# EAGLE design net (EAGLE 7.0.0)
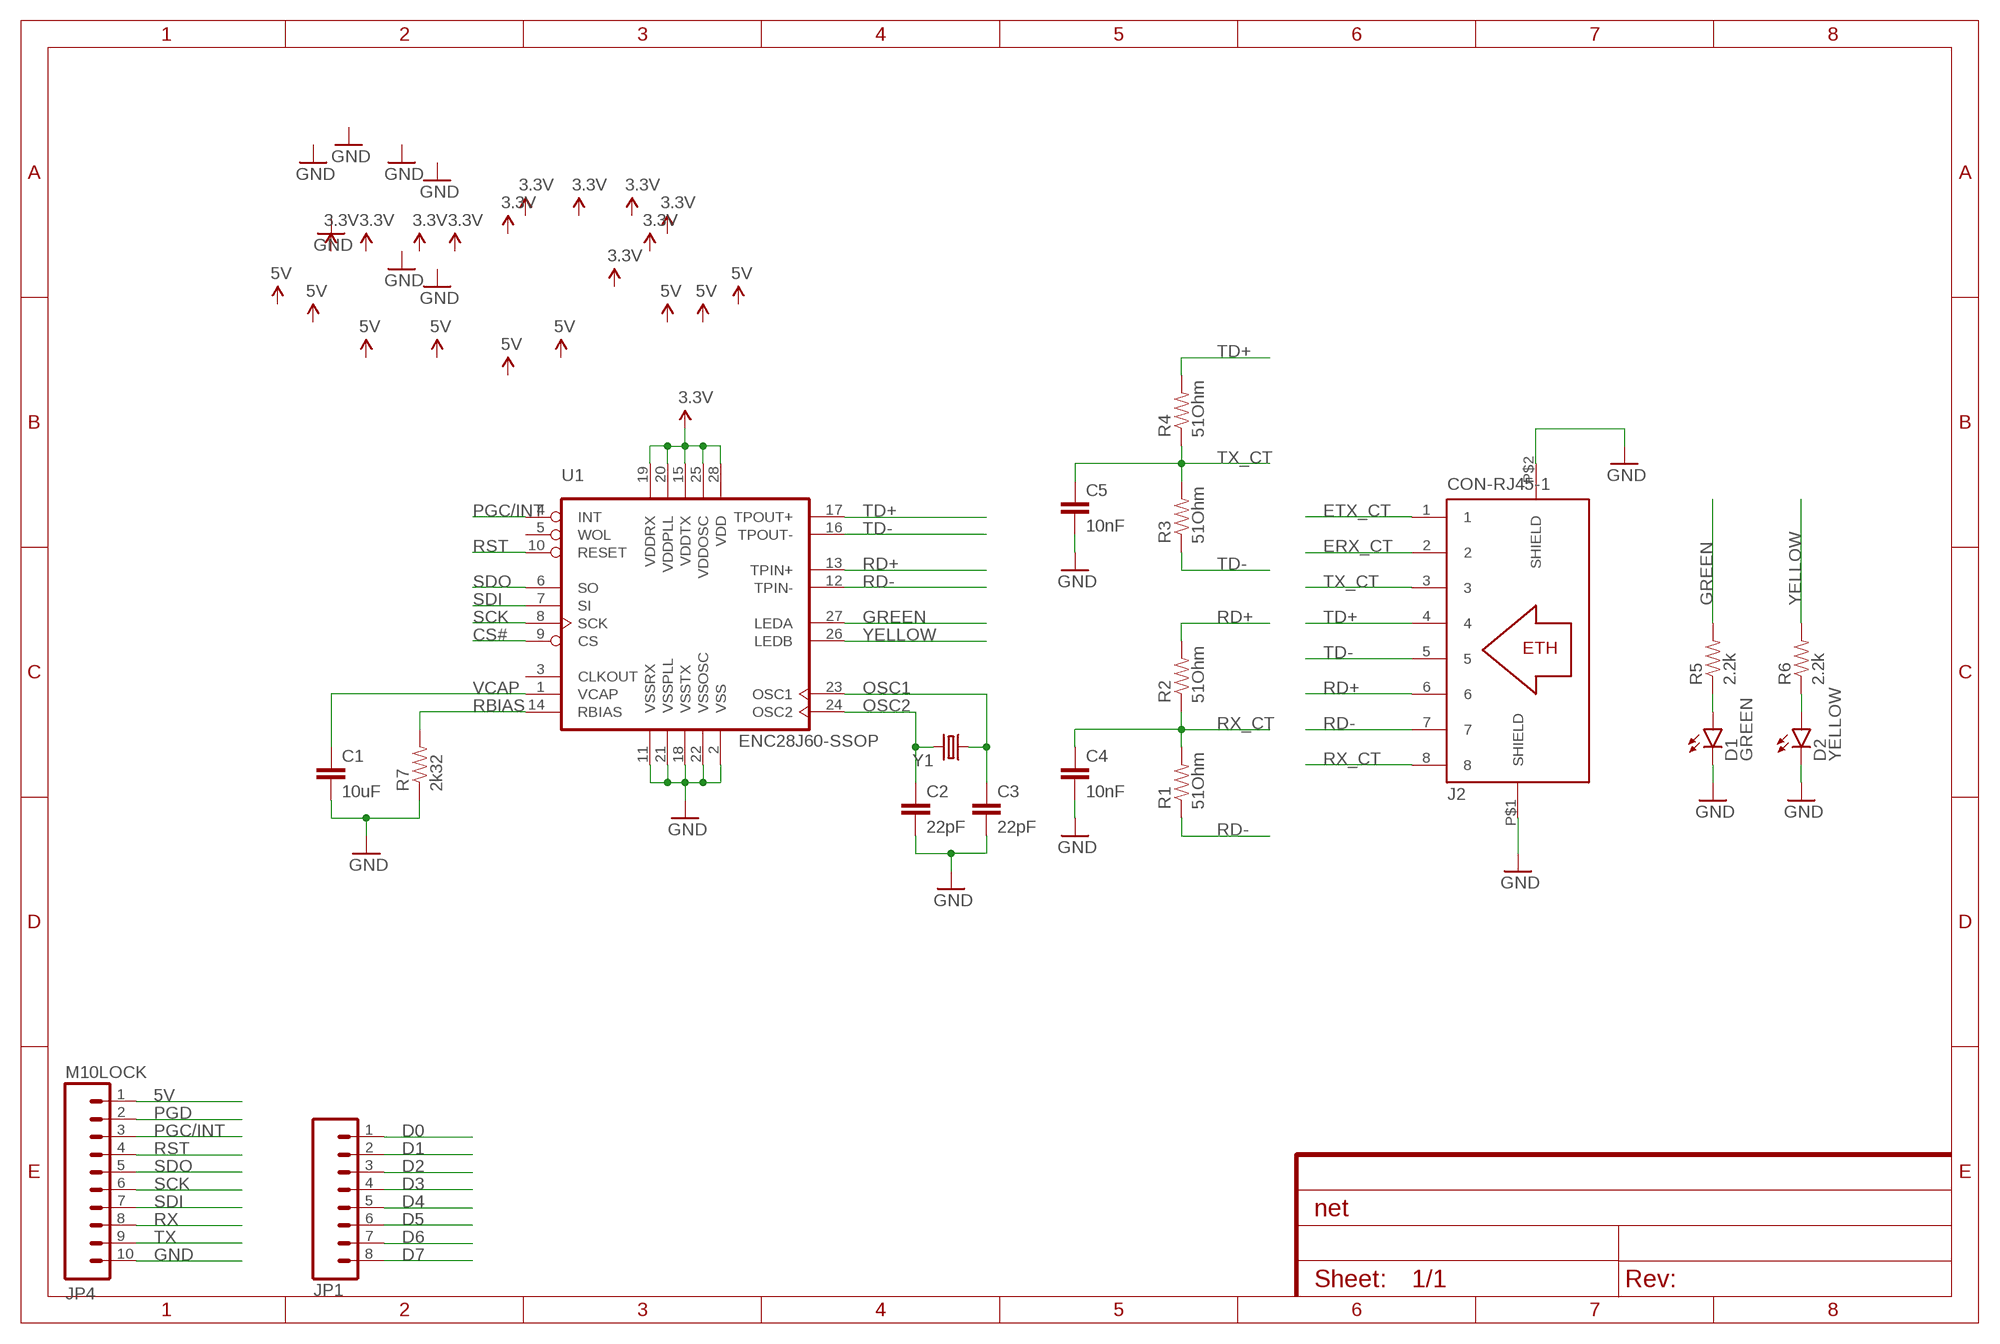
[diagram p0: schematic, sheet 1]

## Parts
C1  10uF  10UF-6.3V-20%(0603)  [0603-CAP]
C2  22pF  22PF-50V-5%(0603)  [0603-CAP]
C3  22pF  22PF-50V-5%(0603)  [0603-CAP]
C4  10nF  10NF/10000PF-50V-10%(0603)  [0603-CAP]
C5  10nF  10NF/10000PF-50V-10%(0603)  [0603-CAP]
D1  GREEN  LED-RED0603  [LED-0603]
D2  YELLOW  LED-RED0603  [LED-0603]
J2  CON-RJ45-1  [GM-SMT2-S2-88]
JP1  M08LOCK  [1X08_LOCK]
JP4  M10LOCK  [1X10_LOCK]
R1  51Ohm  33OHM1/10W1%(0603)  [0603]
R2  51Ohm  33OHM1/10W1%(0603)  [0603]
R3  51Ohm  33OHM1/10W1%(0603)  [0603]
R4  51Ohm  33OHM1/10W1%(0603)  [0603]
R5  2.2k  2.2KOHM1/10W1%(0603)  [0603-RES]
R6  2.2k  2.2KOHM1/10W1%(0603)  [0603-RES]
R7  2k32  2.2KOHM1/10W1%(0603)  [0603-RES]
U1  ENC28J60-SSOP  [SSOP28]
Y1  CRYSTAL5X3  [CRYSTAL-SMD-5X3]

## Nets
3.3V: U1.15(VDDTX) U1.19(VDDRX) U1.20(VDDPLL) U1.25(VDDOSC) U1.28(VDD)
5V: JP4.1
CS#: U1.9(CS)
D0: JP1.1
D1: JP1.2
D2: JP1.3
D3: JP1.4
D4: JP1.5
D5: JP1.6
D6: JP1.7
D7: JP1.8
ERX_CT: J2.2
ETX_CT: J2.1
GND: C1.2 C2.2 C3.2 C4.2 C5.2 D1.C D2.C J2.P$1(SHIELD) J2.P$2(SHIELD) JP4.10 R7.1 U1.2(VSS) U1.11(VSSRX) U1.18(VSSTX) U1.21(VSSPLL) U1.22(VSSOSC)
GREEN: R5.2 U1.27(LEDA)
N$5: D1.A R5.1
N$6: D2.A R6.1
OSC1: C3.1 U1.23(OSC1) Y1.1
OSC2: C2.1 U1.24(OSC2) Y1.3
PGC/INT: JP4.3 U1.4(INT)
PGD: JP4.2
RBIAS: R7.2 U1.14(RBIAS)
RD+: J2.6 R2.2 U1.13(TPIN+)
RD-: J2.7 R1.1 U1.12(TPIN-)
RST: JP4.4 U1.10(RESET)
RX: JP4.8
RX_CT: C4.1 J2.8 R1.2 R2.1
SCK: JP4.6 U1.8(SCK)
SDI: JP4.7 U1.7(SI)
SDO: JP4.5 U1.6(SO)
TD+: J2.4 R4.2 U1.17(TPOUT+)
TD-: J2.5 R3.1 U1.16(TPOUT-)
TX: JP4.9
TX_CT: C5.1 J2.3 R3.2 R4.1
VCAP: C1.1 U1.1(VCAP)
YELLOW: R6.2 U1.26(LEDB)
Unconnected: U1.3(CLKOUT) U1.5(WOL)

## Library data of the parts
C1 = SparkFun-Capacitors:10UF-6.3V-20%(0603): CAP-11015; PROD_ID: CAP-11015
C2 C3 = SparkFun-Capacitors:22PF-50V-5%(0603): CAP-07876; PROD_ID: CAP-07876
C4 C5 = SparkFun-Capacitors:10NF/10000PF-50V-10%(0603): CAP-00867; PROD_ID: CAP-00867
D1 D2 = SparkFun-LED:LED-RED: Assorted Red LEDs LilyPad 1206- DIO-09912 1206- DIO-00809 0603- DIO-00819; PROD_ID: DIO-00819; VALUE: RED
J2 = m-pad-2.1:CON-RJ45: Various RJ45 Surface Mount Jacks Kycon Molex Please send any comments to: messi@users.sourceforge.net
JP1 = SparkFun-Connectors:M08: Header 8 Standard 8-pin 0.1" header. Use with straight break away headers (SKU : PRT-00116), right angle break away headers (PRT-00553), swiss pins (PRT-00743), machine pins (PRT-00117), and female headers (PRT-00115).
JP4 = SparkFun-Connectors:M10: Header 10 Standard 10-pin 0.1" header. Use with straight break away headers (SKU : PRT-00116), right angle break away headers (PRT-00553), swiss pins (PRT-00743), machine pins (PRT-00117), and female headers (PRT-00115).
R1-R4 = SparkFun-Resistors:33OHM1/10W1%(0603): RES-08270; PROD_ID: RES-08270; VALUE: 33OHM
R5 R6 = SparkFun-Resistors:2.2KOHM1/10W1%(0603): RES-08272; PROD_ID: RES-08272
R7 = SparkFun-Resistors:2.2KOHM1/10W1%(0603): RES-08272; PROD_ID: RES-08272; VALUE: 2.2k
U1 = microchip-enc28j60:ENC28J60-*: Microchip 10Mbit Eth. contoller with SPI interface
Y1 = SparkFun-FreqCtrl:CRYSTAL: Various standard crystals. Proven footprints. Spark Fun Electronics SKU : COM-00534

## Board
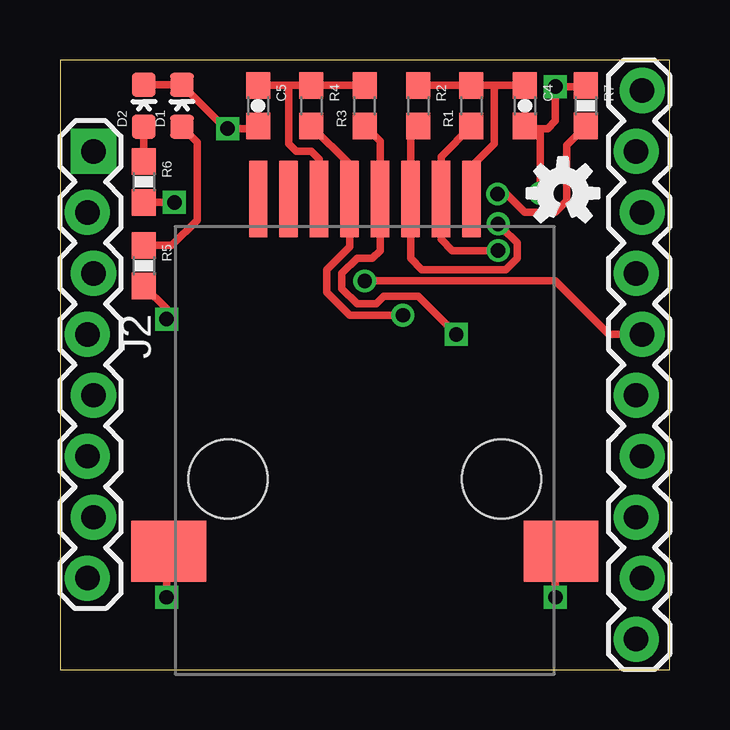
[diagram p1: board, top side]
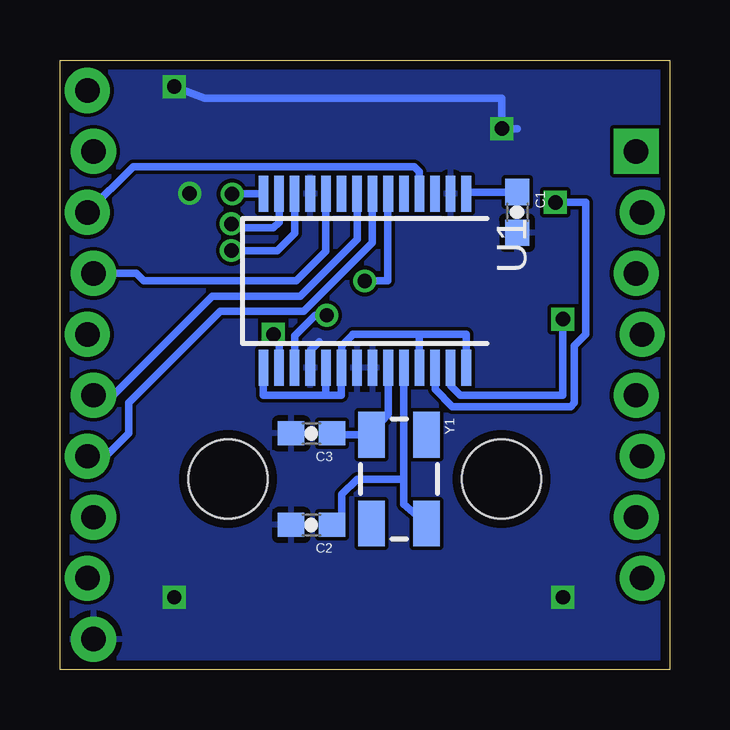
[diagram p2: board, bottom side, seen from below]

Size 25.4 x 25.4 mm. Coordinates in mm from the lower left corner, seen from the top.
Outline: 0,0 25.4,0 25.4,25.4 0,25.4 0,0
Copper layers (1*16): Top 0.0356mm / dielectric 1.5011mm / Bottom 0.0356mm
Design rules "LaenPCBOrder": minimum track width 6mil, minimum drill 13mil, track to track 6mil, track to pad 6mil, pad to pad 6mil, via to via 6mil, smd to smd 6mil, copper to edge 15mil, drill to drill 6mil, minimum pad ring 7mil, minimum via ring 7mil, stop-mask expansion 3mil, vias tented up to drill 0mil, thermal gap 10mil

### Footprints (pad centres in the part's own frame; a part is rotated, then mirrored left to right if it is on the bottom)
0603-CAP = smd 1.1 x 1: 1 -0.85,0; 2 0.85,0
LED-0603 = smd 1 x 1: A 0,-0.877; C 0,0.877
GM-SMT2-S2-88 = smd 0.76 x 3.185: 1 -4.445,11.665; 2 -3.175,11.665; 3 -1.905,11.665; 4 -0.635,11.665; 5 0.635,11.665; 6 1.905,11.665; 7 3.175,11.665; 8 4.445,11.665 | smd 3.12 x 2.54: P$1 -8.175,-3.005; P$2 8.175,-3.005 | hole 3.3: -5.7,0; 5.7,0
1X08_LOCK = drill 1.016 pad 1.88 square: 1 0,0.127 | drill 1.016 pad 1.88: 2 2.54,-0.127; 3 5.08,0.127; 4 7.62,-0.127; 5 10.16,0.127; 6 12.7,-0.127; 7 15.24,0.127; 8 17.78,-0.127
1X10_LOCK = drill 1.016 pad 1.88: 1 0,0.127; 2 2.54,-0.127; 3 5.08,0.127; 4 7.62,-0.127; 5 10.16,0.127; 6 12.7,-0.127; 7 15.24,0.127; 8 17.78,-0.127; 9 20.32,0.127; 10 22.86,-0.127
0603 = smd 1.1 x 1: 1 -0.85,0; 2 0.85,0
0603-RES = smd 1.1 x 1: 1 -0.85,0; 2 0.85,0
SSOP28 = smd 0.4 x 1.5: 1 -4.225,-3.625; 2 -3.575,-3.625; 3 -2.925,-3.625; 4 -2.275,-3.625; 5 -1.625,-3.625; 6 -0.975,-3.625; 7 -0.325,-3.625; 8 0.325,-3.625; 9 0.975,-3.625; 10 1.625,-3.625; 11 2.275,-3.625; 12 2.925,-3.625; 13 3.575,-3.625; 14 4.225,-3.625; 15 4.225,3.625; 16 3.575,3.625; 17 2.925,3.625; 18 2.275,3.625; 19 1.625,3.625; 20 0.975,3.625; 21 0.325,3.625; 22 -0.325,3.625; 23 -0.975,3.625; 24 -1.625,3.625; 25 -2.275,3.625; 26 -2.925,3.625; 27 -3.575,3.625; 28 -4.225,3.625
CRYSTAL-SMD-5X3 = smd 1.9 x 1.1: 1 -1.85,-1.15; 2 1.85,-1.15; 3 1.85,1.15; 4 -1.85,1.15

### Placement (x,y rotation side)
C1  6.35,19.05 270 bottom
C2  14.92,6.03 180 bottom
C3  14.92,9.84 180 bottom
C4  19.37,23.5 270 top
C5  8.26,23.5 270 top
D1  5.08,23.5 0 top
D2  3.49,23.5 0 top
J2  12.7,7.94 0 top
JP1  1.27,21.59 270 top
JP4  24.13,24.13 270 top
R1  17.14,23.5 90 top
R2  14.92,23.5 270 top
R3  12.7,23.5 90 top
R4  10.48,23.5 270 top
R5  3.49,16.83 270 top
R6  3.49,20.32 270 top
R7  21.91,23.5 270 top
U1  12.7,16.19 180 bottom
U$1  [OSHW-LOGO-S]  20.95,19.84 0 top
Y1  11.27,7.94 270 bottom

### Tracks (layer width: path | path; a pad name or v marks a point on that pad's centre or on a via)
3.3V
  Bottom 0.305: U1.28 8.47,13.97 10.43,13.97 | 10.43,13.97 13.2,13.97 13.2,13.95 13.65,13.49 U1.20 13.68,11.43 14.29,11.43 | U1.25 10.43,13.97 | U1.15 16.93,11.43 14.29,11.43 | U1.19 14.32,11.47 14.29,11.43
GND  (via drill 0.6)
  Top 0.305: C5.2 8.15,22.54 v6.99,22.54 6.91,22.54 D1.C D2.C | C4.2 19.47,22.54 19.84,22.54 | J2.P$2 20.64,4.7 v20.64,3.02 | J2.P$1 4.45,4.85 v4.45,3.02 | 19.84,22.54 20.32,22.54 20.64,22.86 v20.64,24.29 21.85,24.29 R7.1 | v20,19.84 20,22.38 19.84,22.54
  Bottom 0.305: 6.35,22.54 v6.99,22.54 6.99,23.81 19.37,23.81 v20.64,24.29 | U1.18 14.97,13.28 14.61,13.65
  pour Bottom: 0,25.4 25.4,25.4 25.4,0 0,0
GREEN  (via drill 0.6)
  Top 0.305: v4.45,14.61 4.45,15.03 R5.2
  Bottom 0.305: v4.45,14.61 4.45,11.43 8.73,11.43 9.12,11.82 U1.27
N$5
  Top 0.305: R5.1 4.66,17.68 5.71,18.73 5.71,21.98 D1.A
N$6
  Top 0.305: R6.1 D2.A
OSC1
  Bottom 0.305: U1.23 11.72,10.64 Y1.1 14.02,9.79 C3.1
OSC2
  Bottom 0.305: Y1.3 11.07,6.88 11.07,7.94 | C2.1 13.65,6.45 13.65,7.3 13.02,7.94 11.07,7.94 | U1.24 11.07,7.94
PGC/INT
  Bottom 0.305: JP4.3 22.35,20.95 10.64,20.95 10.43,20.74 U1.4
RBIAS  (via drill 0.6)
  Top 0.305: v18.23,19.82 18.6,19.82 19.37,19.05 20.64,19.05 21.11,19.53 21.11,21.85 R7.2
  Bottom 0.305: U1.14 v18.23,19.82
RD+  (via drill 0.6)
  Top 0.305: R2.2 14.61,22.33 J2.6 14.61,17.14 15.08,16.67 18.57,16.67 19.05,17.14 19.05,17.78 18.41,18.41 18.26,18.41 v18.26,18.57
  Bottom 0.305: U1.13 16.27,18.65 16.51,18.41 17.94,18.41 18.26,18.41 v18.26,18.57
RD-  (via drill 0.6)
  Top 0.305: R1.1 15.88,21.38 J2.7 15.88,17.94 16.35,17.46 v18.26,17.46
  Bottom 0.305: U1.12 15.62,18.19 16.35,17.46 v18.26,17.46
RST
  Bottom 0.305: JP4.4 22.23,16.51 21.91,16.19 15.56,16.19 14.32,17.43 U1.10
RX_CT
  Top 0.305: J2.8 17.14,20.95 18.1,21.91 18.1,24.34 | R2.1 R1.2 18.1,24.34 | 18.1,24.34 C4.1
SCK
  Bottom 0.305: JP4.6 23.18,11.43 19.05,15.56 15.4,15.56 13.02,17.94 U1.8
SDI
  Bottom 0.305: JP4.7 23.5,8.89 22.54,9.84 22.54,11.11 18.73,14.92 15.24,14.92 12.38,17.78 U1.7
SDO  (via drill 0.6)
  Top 0.305: JP4.5 22.86,13.97 20.64,16.19 v12.7,16.19
  Bottom 0.305: U1.6 11.75,19.8 11.75,16.19 v12.7,16.19
TD+  (via drill 0.6)
  Top 0.305: R4.2 12.06,21.06 J2.4 12.06,17.62 11.11,16.67 11.11,15.72 12.06,14.76 v14.29,14.76
  Bottom 0.305: U1.17 15.62,13.9 14.76,14.76 v14.29,14.76
TD-  (via drill 0.6)
  Top 0.305: R3.1 13.34,22.01 J2.5 13.34,17.46 13.02,17.14 12.38,17.14 11.75,16.51 11.75,15.88 12.38,15.24 13.18,15.24 13.49,15.56 14.92,15.56 v16.51,13.97
  Bottom 0.305: U1.16 16.27,13.73 v16.51,13.97
TX_CT
  Top 0.305: J2.3 10.79,21.27 10.48,21.59 9.84,21.59 9.53,21.91 9.53,24.34 | C5.1 9.53,24.34 | 9.53,24.34 R4.1 R3.2
VCAP
  Bottom 0.305: U1.1 8.39,19.9 C1.1
YELLOW  (via drill 0.6)
  Top 0.305: v4.76,19.47 R6.2
  Bottom 0.305: U1.26 9.78,11.68 9.05,10.95 4.13,10.95 3.97,11.11 3.97,13.49 3.49,13.97 R6.2 v4.76,19.47